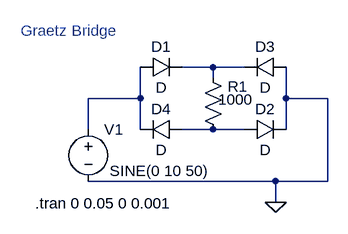
[diagram p0: schematic graetz.asc]
graetz.asc, the LTspice schematic file:
Version 4
SHEET 1 880 680
WIRE 208 32 160 32
WIRE 256 32 208 32
WIRE 208 48 208 32
WIRE 96 80 96 32
WIRE 96 80 16 80
WIRE 320 80 320 32
WIRE 384 80 320 80
WIRE 16 128 16 80
WIRE 96 128 96 80
WIRE 208 128 160 128
WIRE 256 128 208 128
WIRE 320 128 320 80
WIRE 304 208 16 208
WIRE 384 208 384 80
WIRE 384 208 304 208
WIRE 304 240 304 208
FLAG 304 240 0
SYMBOL voltage 16 112 R0
WINDOW 3 33 80 Left 2
WINDOW 123 0 0 Left 0
WINDOW 39 0 0 Left 0
SYMATTR InstName V1
SYMATTR Value SINE(0 10 50)
SYMBOL diode 96 48 R270
WINDOW 0 32 32 VTop 2
WINDOW 3 0 32 VBottom 2
SYMATTR InstName D1
SYMBOL diode 256 144 R270
WINDOW 0 32 32 VTop 2
WINDOW 3 0 32 VBottom 2
SYMATTR InstName D2
SYMBOL diode 320 16 R90
WINDOW 0 0 32 VBottom 2
WINDOW 3 32 32 VTop 2
SYMATTR InstName D3
SYMBOL diode 160 112 R90
WINDOW 0 0 32 VBottom 2
WINDOW 3 32 32 VTop 2
SYMATTR InstName D4
SYMBOL res 192 32 R0
WINDOW 0 38 30 Left 2
WINDOW 3 24 50 Left 2
SYMATTR InstName R1
SYMATTR Value 1000
TEXT -66 242 Left 2 !.tran 0 0.05 0 0.001
TEXT -88 -24 Left 2 ;Graetz Bridge

The netlist it stands for:
* graetz.asc
V1 N002 0 SINE(0 10 50)
D1 N002 N001 D
D2 N003 0 D
D3 0 N001 D
D4 N003 N002 D
R1 N001 N003 1000
.model D D
.lib standard.dio
.tran 0 0.05 0 0.001
* Graetz Bridge
.backanno
.end